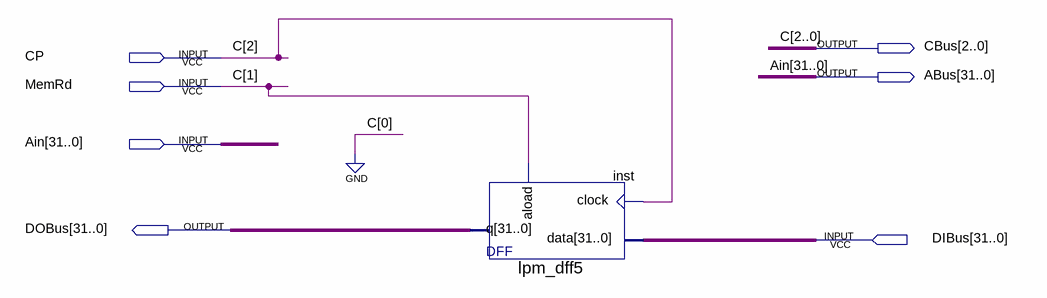
[diagram p0: schematic sheet]
// Quartus schematic IBIU.bdf as structural Verilog: 1 symbols, 7 pins
module IBIU (
  input  CP,
  input  MemRd,
  input  [31:0] Ain,
  input  [31:0] DIBus,
  output [2:0] CBus,
  output [31:0] ABus,
  output [31:0] DOBus
);

  lpm_dff5 inst (.data(DIBus), .clock(CP), .aload(MemRd), .q(DOBus));

  assign ABus = Ain;
  assign CBus = {CP, MemRd, 1'b0};

  // Other names for the same wires on the sheet: C[2:1] = {CP, MemRd}
endmodule
